# EAGLE design ardustatversion9 (EAGLE 6.1)
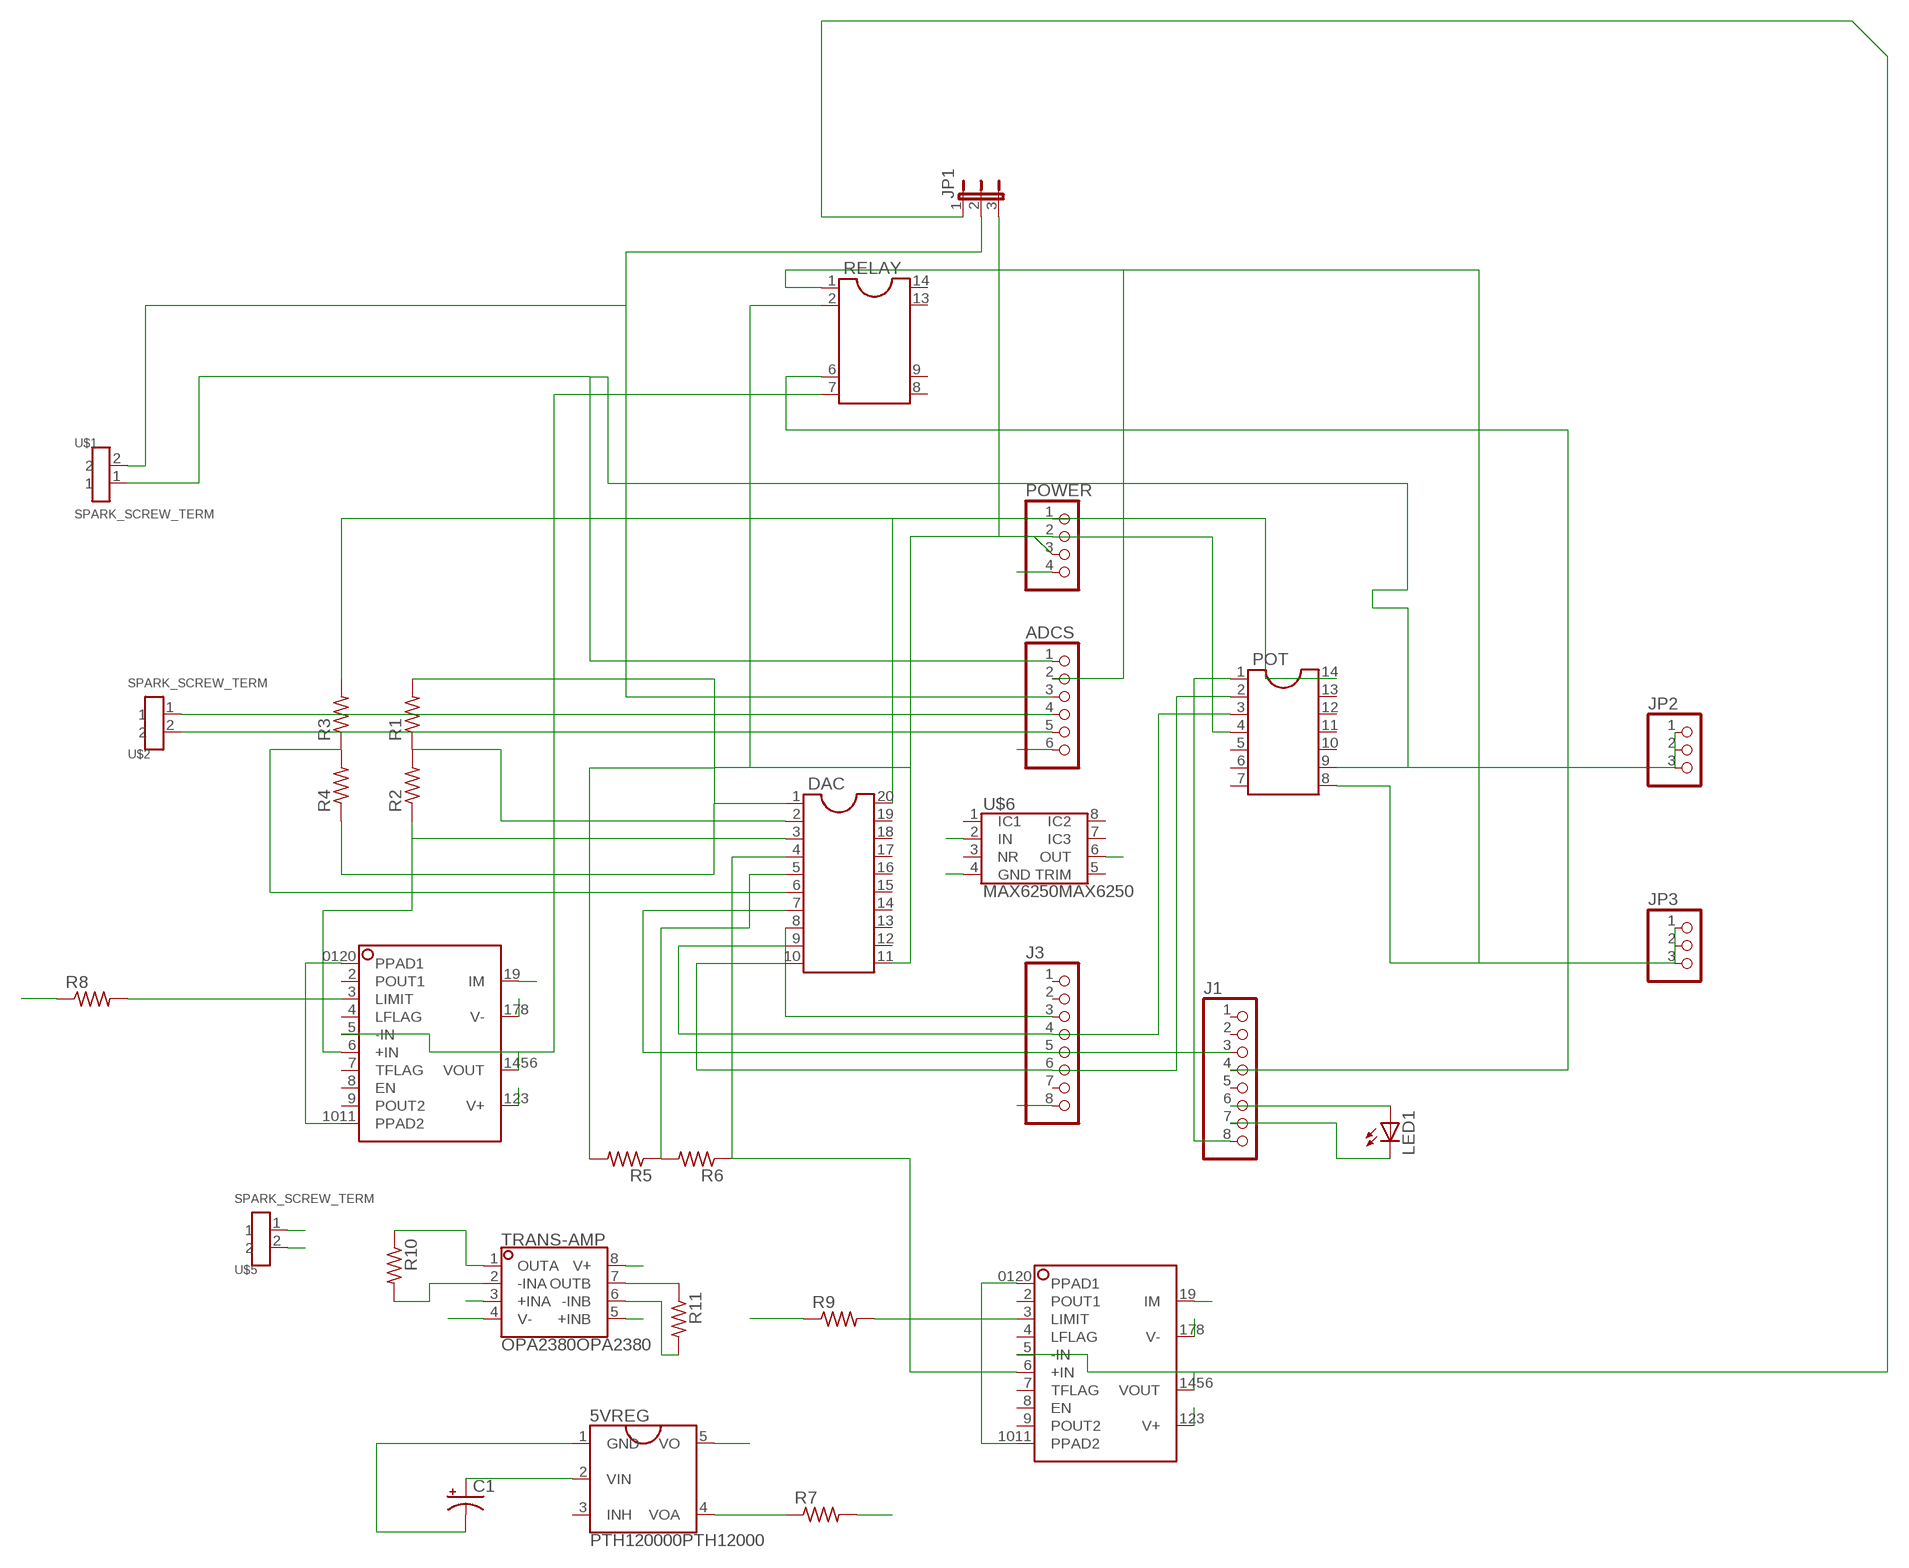
[diagram p0: schematic, sheet 1]

## Parts
5VREG  PTH120000PTH12000  [PTH120000]
ADCS  PINHD-1X6  [1X06]
C1  CPOL-USE5-10.5  [E5-10,5]
DAC  DIL20S  [SOCKED-20]
J1  PINHD-1X8  [1X08]
J3  PINHD-1X8  [1X08]
JP1  JP2E  [JP2]
JP2  PINHD-1X3  [1X03]
JP3  PINHD-1X3  [1X03]
LED1  LED5MM  [LED5MM]
POT  DIL14S  [SOCKET-14]
POWER  PINHD-1X4  [1X04]
R1  R-US_R1206  [R1206]
R2  R-US_R1206  [R1206]
R3  R-US_R1206  [R1206]
R4  R-US_R1206  [R1206]
R5  R-US_R1206  [R1206]
R6  R-US_R1206  [R1206]
R7  R-US_M1206  [M1206]
R8  R-US_R1206  [R1206]
R9  R-US_M1206  [M1206]
R10  R-US_M1206  [M1206]
R11  R-US_M1206  [M1206]
RELAY  DIL14/8  [DIL14/8]
TRANS-AMP  OPA2380OPA2380  [OPA2380]
U$1  SPARK_SCREW_TERM  [SPARK_SCREW_TERM]
U$2  SPARK_SCREW_TERM  [SPARK_SCREW_TERM]
U$3  OPA569OPA569  [OPA569]
U$4  OPA569OPA569  [OPA569]
U$5  SPARK_SCREW_TERM  [SPARK_SCREW_TERM]
U$6  MAX6250MAX6250  [MAX6250]

## Nets
GND: 5VREG.1(GND) C1.- DAC.1 DAC.11 JP1.3 POT.4 POWER.2 POWER.3 R1.2 R4.1 R5.2 R7.2 R8.1 R9.1 RELAY.2 TRANS-AMP.4(V-) U$3.0120(PPAD1) U$3.178(V-) U$3.1011(PPAD2) U$4.0120(PPAD1) U$4.178(V-) U$4.1011(PPAD2) U$5.2 U$6.4(GND)
N$1: DAC.6 R3.1 R4.2
N$2: DAC.10 J3.6 POT.2
N$3: DAC.9 J3.4 POT.3
N$4: DAC.8 J3.3
N$5: DAC.7 J1.3
N$6: J1.4 RELAY.6
N$7: DAC.2 R1.1 R2.2
N$8: ADCS.1 JP2.1 JP2.2 JP2.3 POT.9 U$1.1
N$9: J1.8 POT.1
N$10: R10.2 TRANS-AMP.2(-INA) U$3.19(IM)
N$11: ADCS.2 JP3.1 JP3.2 JP3.3 POT.8 RELAY.1 TRANS-AMP.5(+INB)
N$12: DAC.5 R5.1 R6.2
N$13: R8.2 U$3.3(LIMIT)
N$14: ADCS.5 R10.1 TRANS-AMP.1(OUTA) U$2.2
N$15: DAC.3 R2.1 U$3.6(+IN)
N$16: R9.2 U$4.3(LIMIT)
N$17: J1.6 LED1.A
N$18: J1.7 LED1.K(C)
N$19: 5VREG.5(VO) TRANS-AMP.8(V+) U$3.123(V+) U$4.123(V+)
N$20: ADCS.4 U$2.1
N$21: ADCS.3 JP1.2 TRANS-AMP.3(+INA) U$1.2
N$22: 5VREG.2(VIN) C1.+ POWER.4 U$5.1 U$6.2(IN)
N$24: J3.8 U$6.6(OUT)
N$25: 5VREG.4(VOA) R7.1
N$26: RELAY.7 U$3.5(-IN) U$3.1456(VOUT)
N$27: JP1.1 U$4.5(-IN) U$4.1456(VOUT)
N$29: DAC.20 POT.14 POWER.1 R3.2
N$32: DAC.4 R6.1 U$4.6(+IN)
N$48: ADCS.6 R11.1 TRANS-AMP.7(OUTB)
N$49: R11.2 TRANS-AMP.6(-INB) U$4.19(IM)
Unconnected: 5VREG.3(INH) DAC.12 DAC.13 DAC.14 DAC.15 DAC.16 DAC.17 DAC.18 DAC.19 J1.1 J1.2 J1.5 J3.1 J3.2 J3.5 J3.7 POT.5 POT.6 POT.7 POT.10 POT.11 POT.12 POT.13 RELAY.8 RELAY.9 RELAY.13 RELAY.14 U$3.2(POUT1) U$3.4(LFLAG) U$3.7(TFLAG) U$3.8(EN) U$3.9(POUT2) U$4.2(POUT1) U$4.4(LFLAG) U$4.7(TFLAG) U$4.8(EN) U$4.9(POUT2) U$6.1(IC1) U$6.3(NR) U$6.5(TRIM) U$6.7(IC3) U$6.8(IC2)

## Library data of the parts
5VREG = ardustat:PTH120000
ADCS = pinhead:PINHD-1X6: PIN HEADER
C1 = rcl:CPOL-US: POLARIZED CAPACITOR, American symbol
DAC = ic-package:DIL20: Dual In Line
J1 J3 = pinhead:PINHD-1X8: PIN HEADER
JP1 = jumper:JP2E: JUMPER
JP2 JP3 = pinhead:PINHD-1X3: PIN HEADER
LED1 = led:LED: LED OSRAM: - CHIPLED LG R971, LG N971, LY N971, LG Q971, LY Q971, LO R971, LY R971 LH N974, LH R974 LS Q976, LO Q976, LY Q976 LO Q996 - Hyper CHIPLED LW Q18S LB Q993, LB Q99A, LB R99A - SideLED LS A670, LO A670, LY A670, LG A670, LP A670 LB A673, LV A673, LT A673, LW A673 LH A674 LY A675 LS A676, LA A676, LO A676, LY A676, LW A676 LS A679, LY A679, LG A679 - Hyper Micro SIDELED® LS Y876, LA Y876, LO Y876, LY Y876 LT Y87S - SmartLED LW L88C, LW L88S LB L89C, LB L89S, LG L890 LS L89K, LO L89K, LY L89K LS L896, LA L896, LO L896, LY L896 - TOPLED LS T670, LO T670, LY T670, LG T670, LP T670 LSG T670, LSP T670, LSY T670, LOP T670, LYG T670 LG T671, LOG T671, LSG T671 LB T673, LV T673, LT T673, LW T673 LH T674 LS T676, LA T676, LO T676, LY T676, LB T676, LH T676, LSB T676, LW T676 LB T67C, LV T67C, LT T67C, LS T67K, LO T67K, LY T67K, LW E67C LS E67B, LA E67B, LO E67B, LY E67B, LB E67C, LV E67C, LT E67C LW T67C LS T679, LY T679, LG T679 LS T770, LO T770, LY T770, LG T770, LP T770 LB T773, LV T773, LT T773, LW T773 LH T774 LS E675, LA E675, LY E675, LS T675 LS T776, LA T776, LO T776, LY T776, LB T776 LHGB T686 LT T68C, LB T68C - Hyper Mini TOPLED® LB M676 - Mini TOPLED Santana® LG M470 LS M47K, LO M47K, LY M47K Source: http://www.osram.convergy.de - LUMILED® LXK2-PW12-R00, LXK2-PW12-S00, LXK2-PW14-U00, LXK2-PW14-V00 LXK2-PM12-R00, LXK2-PM12-S00, LXK2-PM14-U00 LXK2-PE12-Q00, LXK2-PE12-R00, LXK2-PE12-S00, LXK2-PE14-T00, LXK2-PE14-U00 LXK2-PB12-K00, LXK2-PB12-L00, LXK2-PB12-M00, LXK2-PB14-N00, LXK2-PB14-P00, LXK2-PB14-Q00 LXK2-PR12-L00, LXK2-PR12-M00, LXK2-PR14-Q00, LXK2-PR14-R00 LXK2-PD12-Q00, LXK2-PD12-R00, LXK2-PD12-S00 LXK2-PH12-R00, LXK2-PH12-S00 LXK2-PL12-P00, LXK2-PL12-Q00, LXK2-PL12-R00 Source: www.luxeon.com
POT = ic-package:DIL14: Dual In Line / Socket
POWER = pinhead:PINHD-1X4: PIN HEADER
R1 R3-R11 = rcl:R-US_: RESISTOR, American symbol
R2 = resistor:R-US_: RESISTOR, American symbol
RELAY = ic-package:DIL14/8: Dual In Line
TRANS-AMP = ardustat:OPA2380
U$1 U$2 U$5 = ardustat:SPARK_SCREW_TERM
U$3 U$4 = ardustat:OPA569
U$6 = ardustat:MAX6250

## Board
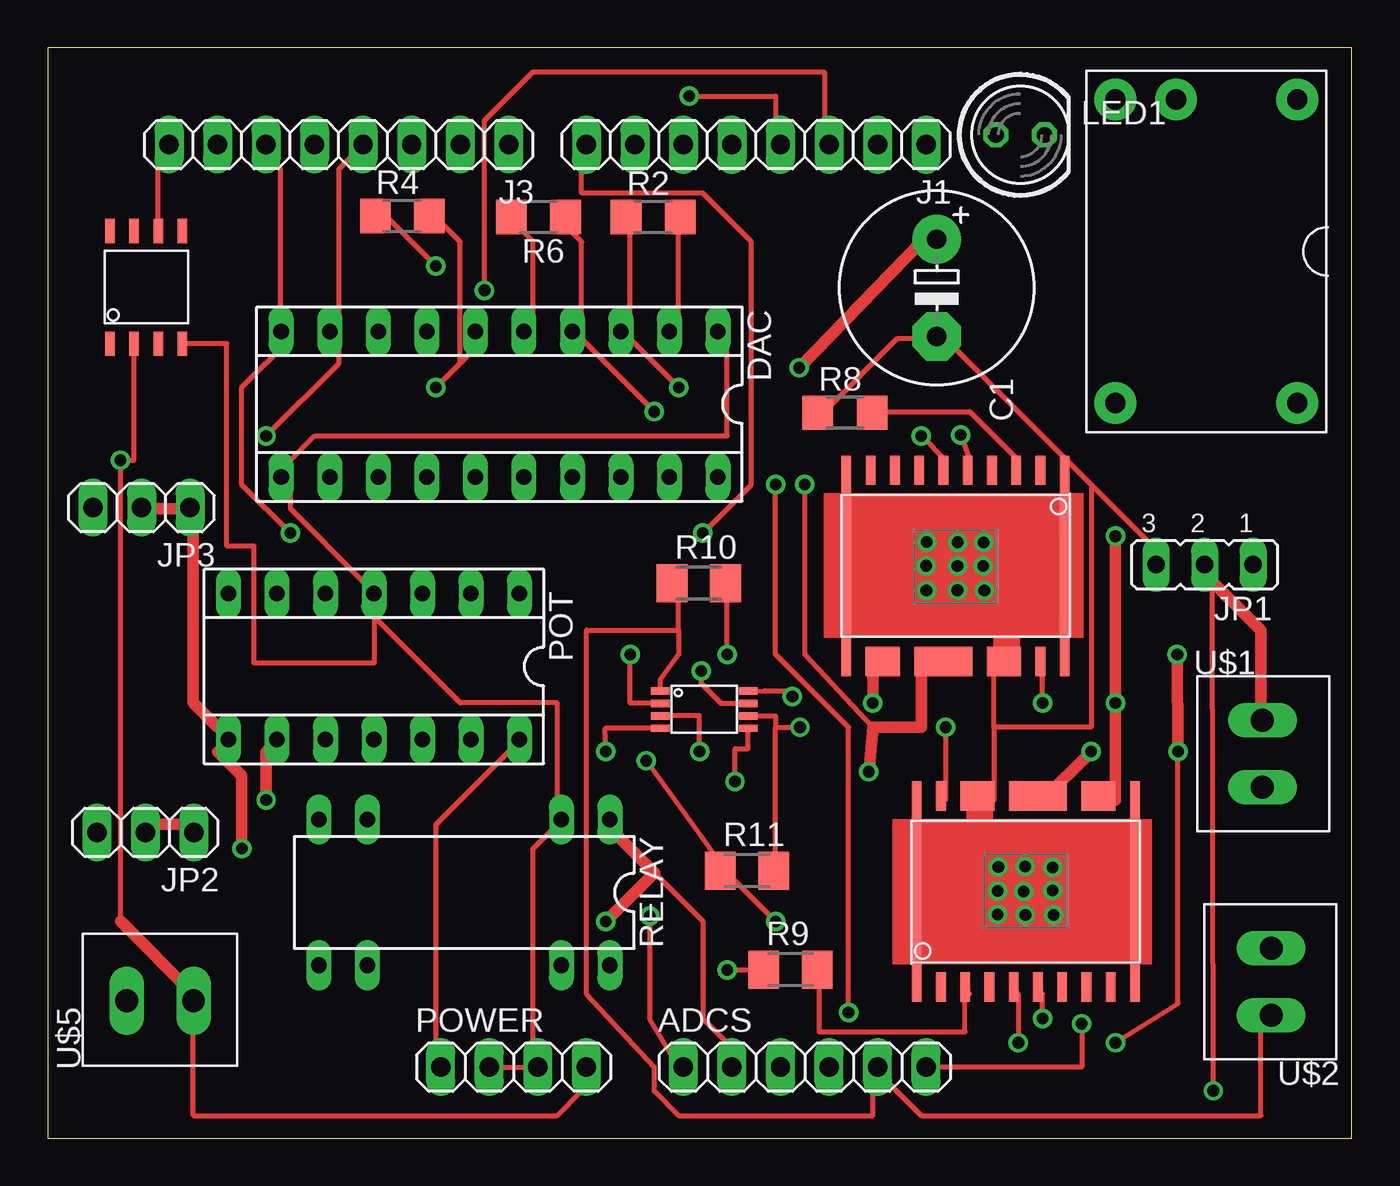
[diagram p1: board, top side]
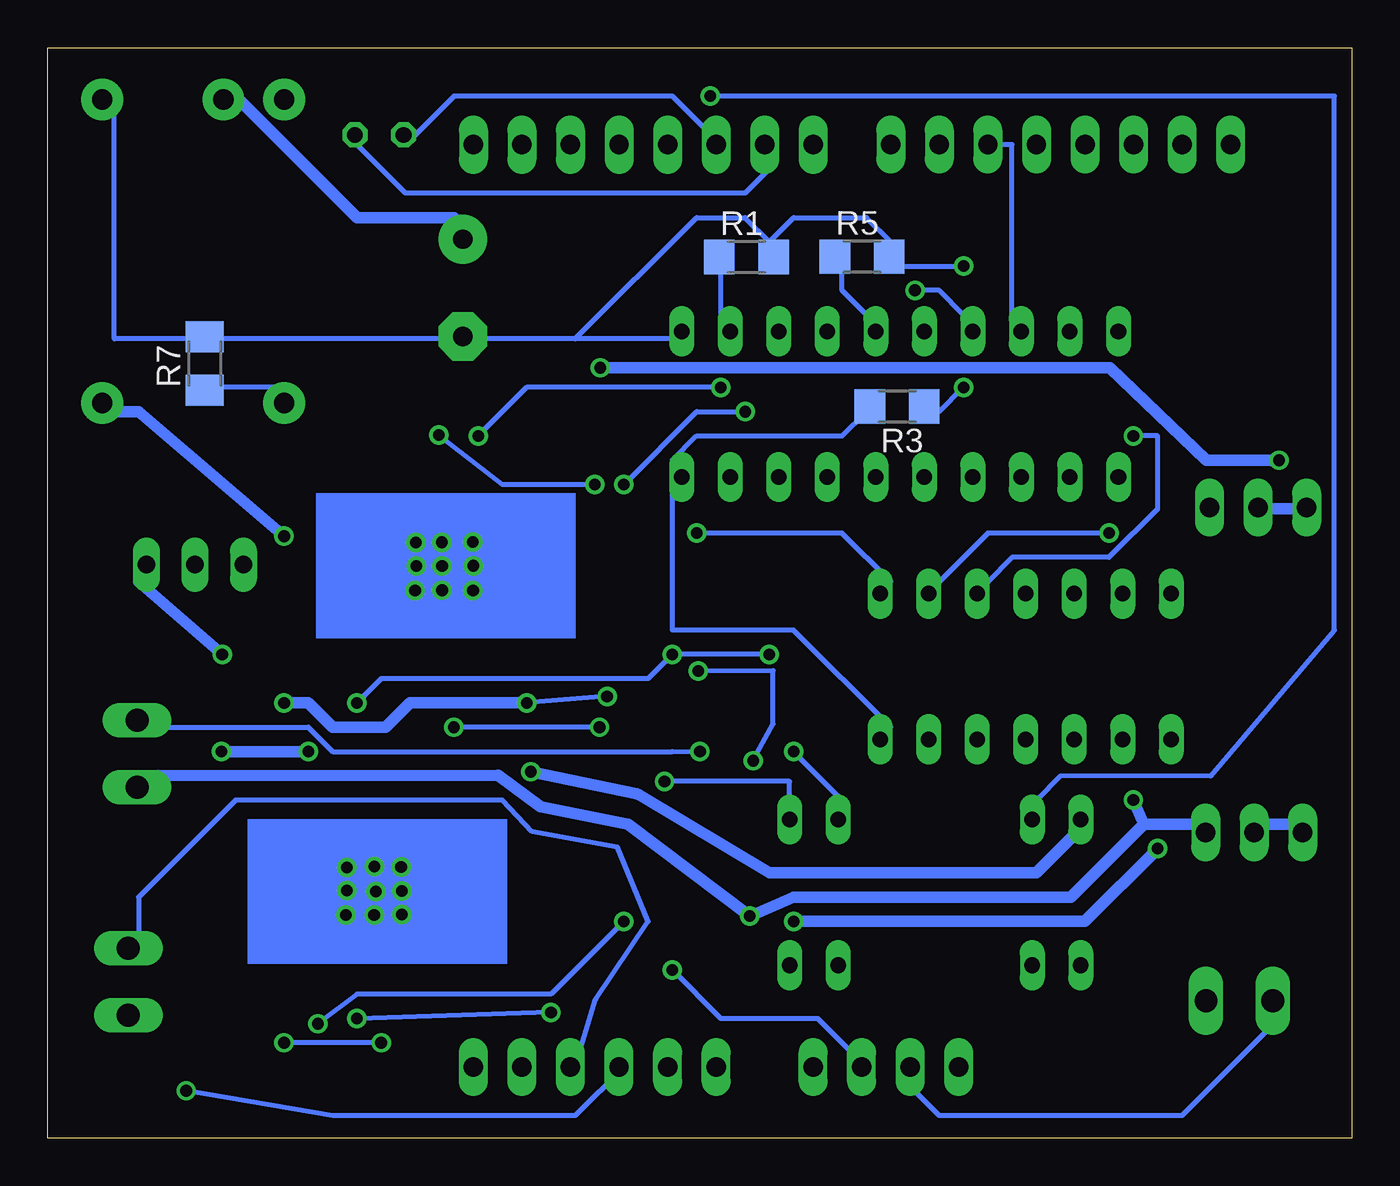
[diagram p2: board, bottom side, seen from below]

Size 68.25 x 57.05 mm. Coordinates in mm from the lower left corner, seen from the top.
Outline: 0,0 68.25,0 68.25,57.05 0,57.05 0,0
Copper layers (1*16): Top 0.035mm / dielectric 1.5mm / Bottom 0.035mm
Design rules: minimum track width 10mil, minimum drill 24mil, track to track 8mil, track to pad 8mil, pad to pad 8mil, via to via 8mil, smd to smd 8mil, copper to edge 40mil, drill to drill 8mil, minimum pad ring 10mil, minimum via ring 8mil, stop-mask expansion 4mil, vias tented up to drill 0mil, thermal gap 0mil

### Footprints (pad centres in the part's own frame; a part is rotated, then mirrored left to right if it is on the bottom)
PTH120000 = drill 1.06 pad 2.184: 1 -7.94,4.76; 2 -7.94,-1.59; 3 -7.94,-4.76; 4 7.94,-4.76; 5 7.94,4.76
1X06 = drill 1.016 long: 1 -6.35,0; 2 -3.81,0; 3 -1.27,0; 4 1.27,0; 5 3.81,0; 6 6.35,0
E5-10,5 = drill 1.016 pad 2.54: + -2.54,0 | drill 1.016 pad 2.54 octagon: - 2.54,0
SOCKED-20 = drill 0.813 long: 1 -11.43,-3.81; 2 -8.89,-3.81; 3 -6.35,-3.81; 4 -3.81,-3.81; 5 -1.27,-3.81; 6 1.27,-3.81; 7 3.81,-3.81; 8 6.35,-3.81; 9 8.89,-3.81; 10 11.43,-3.81; 11 11.43,3.81; 12 8.89,3.81; 13 6.35,3.81; 14 3.81,3.81; 15 1.27,3.81; 16 -1.27,3.81; 17 -3.81,3.81; 18 -6.35,3.81; 19 -8.89,3.81; 20 -11.43,3.81
1X08 = drill 1.016 long: 1 -8.89,0; 2 -6.35,0; 3 -3.81,0; 4 -1.27,0; 5 1.27,0; 6 3.81,0; 7 6.35,0; 8 8.89,0
JP2 = drill 0.914 long: 1 -2.54,0; 2 0,0; 3 2.54,0
1X03 = drill 1.016 long: 1 -2.54,0; 2 0,0; 3 2.54,0
LED5MM = drill 0.813 octagon: A -1.27,0; K 1.27,0
SOCKET-14 = drill 0.813 long: 1 -7.62,-3.81; 2 -5.08,-3.81; 3 -2.54,-3.81; 4 0,-3.81; 5 2.54,-3.81; 6 5.08,-3.81; 7 7.62,-3.81; 8 7.62,3.81; 9 5.08,3.81; 10 2.54,3.81; 11 0,3.81; 12 -2.54,3.81; 13 -5.08,3.81; 14 -7.62,3.81
1X04 = drill 1.016 long: 1 -3.81,0; 2 -1.27,0; 3 1.27,0; 4 3.81,0
R1206 = smd 1.6 x 1.803: 1 -1.422,0; 2 1.422,0
M1206 = smd 1.6 x 2: 1 -1.4,0; 2 1.4,0
DIL14/8 = drill 0.813 long: 1 -7.62,-3.81; 2 -5.08,-3.81; 6 5.08,-3.81; 7 7.62,-3.81; 8 7.62,3.81; 9 5.08,3.81; 13 -5.08,3.81; 14 -7.62,3.81
OPA2380 = smd 0.975 x 0.38: 1 -2.259,0.982; 2 -2.259,0.332; 3 -2.259,-0.318; 4 -2.259,-0.968; 5 2.351,-0.968; 6 2.351,-0.318; 7 2.351,0.332; 8 2.351,0.982
SPARK_SCREW_TERM = drill 1.2 long: 1 0,-1.8; 2 0,1.7
OPA569 = smd 1.53 x 0.51: 2 -5,4.343; 3 -5,3.073; 4 -5,1.803; 5 -5,0.533; 6 -5,-0.737; 7 -5,-2.007; 8 -5,-3.277; 9 -5,-4.547; 19 5,4.343 | smd 11.53 x 0.51: 0120 0,5.613; 1011 0,-5.817 | smd 1.53 x 1.781: 123 5,-3.913; 178 5,2.438 | smd 1.53 x 3.051: 1456 5,-0.738
MAX6250 = smd 1.27 x 0.49: 1 -3.012,1.903; 2 -3.012,0.633; 3 -3.012,-0.637; 4 -3.012,-1.907; 5 2.888,-1.907; 6 2.888,-0.637; 7 2.888,0.633; 8 2.888,1.903

### Placement (x,y rotation side)
5VREG  60.64,46.4 270 top
ADCS  39.62,3.72 0 top
C1  46.53,44.49 270 top
DAC  23.64,38.4 180 top
J1  37.08,51.97 180 top
J3  15.24,51.98 180 top
JP1  60.55,30 180 top
JP2  5.11,15.99 180 top
JP3  4.91,32.99 180 top
LED1  50.9,52.49 0 top
POT  17.07,24.68 180 top
POWER  24.38,3.71 0 top
R1  31.68,46.1 0 bottom
R2  31.69,48.19 0 top
R3  23.79,38.28 180 bottom
R4  18.56,48.24 0 top
R5  25.63,46.11 0 bottom
R6  25.68,48.2 180 top
R7  60.03,40.53 90 bottom
R8  41.73,37.95 0 top
R9  38.87,8.81 0 top
R10  34.07,29.02 0 top
R11  36.6,13.99 0 top
RELAY  21.81,12.85 180 top
TRANS-AMP  34.31,22.4 0 top
U$1  63.58,20.15 0 top
U$2  64.03,8.14 180 top
U$3  47.61,29.94 270 top
U$4  51.09,12.9 90 top
U$5  5.83,7.18 90 top
U$6  5.15,44.58 90 top

### Tracks (layer width: path | path; a pad name or v marks a point on that pad's centre or on a via)
GND  (via drill 0.61)
  Top 0.254: 41.88,32.02 41.91,32.02 41.91,31.3 41.8,31.3 U$3.1011 | 53.06,31.96 53.23,31.96 U$3.0120 | 50.12,24.94 U$3.178 49.53,25.31 49.53,21.5 | U$4.0120 48.77,12.9 U$4.1011 | POT.4 16.51,29.12 12.7,32.93 12.7,34.2 DAC.11 12.7,35.47 13.97,36.74 35.56,36.74 35.56,41.82 DAC.1 | v29.21,20.23 29.18,21.44 31.75,21.44 TRANS-AMP.4 | v35.56,8.8 36.83,8.8 R9.1 | 25.4,3.72 22.86,3.72 POWER.2 | 25.4,3.72 25.4,15.15 26.67,16.42 RELAY.2 26.67,17.69 26.67,22.77 21.59,22.77 16.51,27.85 POT.4 | 25.4,3.72 POWER.3 | 49.53,21.5 49.53,17.69 U$4.178 | v20.32,45.63 17.78,48.17 R4.1 | R8.1 40.64,38.01 44.45,41.82 45.72,41.82 C1.- 46.99,41.82 54.61,34.2 | 54.61,34.2 58.42,30.39 JP1.3 | 49.53,21.5 54.61,21.5 54.61,34.2 | U$6.4 9.37,41.57 9.37,30.98 10.79,30.98 10.79,24.85 17.07,24.85 POT.4
  Top 0.406: 41.88,32.02 50.21,32.02 53.06,32.02 53.06,31.96
  Top 1.422: U$3.178 50.21,24.94 50.21,32.02 | U$4.178 48.77,17.9 48.77,12.9
  Bottom 0.254: v29.21,20.23 26.67,17.69 RELAY.2 | v35.56,8.8 33.02,6.26 27.94,6.26 25.4,3.72 POWER.3 | U$5.2 3.81,6.26 8.89,1.18 21.59,1.18 22.86,2.45 POWER.2 | 30.48,46.9 29.21,48.17 25.4,48.17 24.13,46.9 R5.2 24.13,45.63 v20.32,45.63 | 40.64,41.82 45.72,41.82 C1.- 46.99,41.82 59.69,41.82 R7.2 60.96,41.82 64.77,41.82 64.77,54.52 5VREG.1 | 40.64,41.82 35.56,41.82 DAC.1 | 30.48,46.9 31.75,48.17 34.29,48.17 40.64,41.82 | 30.48,46.9 R1.2
N$1  (via drill 0.61)
  Top 0.254: 21.59,40.55 22.86,41.82 DAC.6 | v20.32,39.28 21.59,40.55 | 21.59,40.55 21.59,46.9 20.32,48.17 R4.2
  Bottom 0.254: v20.32,39.28 21.59,38.01 R3.1
N$2  (via drill 0.61)
  Top 0.254: v12.7,31.66 10.16,34.2 10.16,39.28 12.7,41.82 DAC.10 12.18,43.06 12.18,50.68 J3.6
  Bottom 0.254: v12.7,31.66 19.05,31.66 21.59,29.12 POT.2
N$3  (via drill 0.61)
  Top 0.254: v11.43,36.74 15.24,40.55 15.24,41.82 DAC.9 15.24,43.09 15.24,50.71 J3.4
  Bottom 0.254: v11.43,36.74 10.16,36.74 10.16,32.93 12.7,30.39 17.78,30.39 19.05,29.12 POT.3
N$4
  Bottom 0.254: DAC.8 17.78,43.09 17.78,51.98 J3.3
N$5  (via drill 0.61)
  Top 0.254: v22.86,44.36 22.86,53.25 25.4,55.79 40.64,55.79 40.64,51.98 J1.3
  Bottom 0.254: v22.86,44.36 21.59,44.36 20.32,43.09 DAC.7
N$6  (via drill 0.61)
  Top 0.254: v33.58,54.52 38.1,54.52 38.1,51.98 J1.4
  Bottom 0.254: v33.58,54.52 0.91,54.52 0.91,26.58 7.39,18.93 15.24,18.96 16.51,17.69 RELAY.6
N$7
  Top 0.254: R2.2 33.02,48.17 33.02,43.09 DAC.2
  Bottom 0.254: R1.1 33.02,45.63 33.02,43.09 DAC.2
N$8  (via drill 0.61)
  Top 0.254: v31.5,11.61 31.5,6.21 33.02,3.72 ADCS.1 | JP2.2 5.08,16.42 | 7.62,16.42 JP2.1
  Top 0.61: v11.43,17.69 11.43,20.23 POT.9 | 5.08,16.42 7.62,16.42
  Bottom 0.254: JP2.3 2.54,16.42 | 5.08,16.42 JP2.2 | JP2.1 7.62,16.42 | 63.5,18.96 U$1.1
  Bottom 0.61: 2.54,16.42 5.08,16.42 | 10.88,16.42 v11.43,17.69 | 7.62,16.42 10.88,16.42 | 10.88,16.42 14.69,12.61 29.21,12.61 v31.5,11.61 37.88,16.41 42.47,17.33 44.69,18.99 63.5,18.96
N$9  (via drill 0.61)
  Top 0.254: v34.29,31.66 36.83,34.2 36.83,46.9 34.29,49.44 27.94,49.44 27.94,50.71 J1.8
  Bottom 0.254: v34.29,31.66 26.67,31.66 24.13,29.12 POT.1
N$10  (via drill 0.61)
  Top 0.254: v52.07,22.77 52.07,25.31 U$3.19 | v35.56,25.31 35.56,29.12 R10.2 | v30.48,25.31 30.48,22.77 32.05,22.77 TRANS-AMP.2 31.75,22.77
  Bottom 0.254: v52.07,22.77 50.8,24.04 36.83,24.04 v35.56,25.31 v30.48,25.31
N$11  (via drill 0.61)
  Top 0.254: 8.89,21.5 POT.8 8.89,20.23 | 5.08,32.93 JP3.2 | 7.62,32.93 JP3.1 | 31.75,13.88 34.29,11.34 34.29,6.26 35.56,4.99 35.56,3.72 ADCS.2 | 29.21,16.42 RELAY.1 | v35.97,18.66 35.97,20.37 36.66,20.37 TRANS-AMP.5
  Top 0.61: 8.89,21.5 7.62,22.77 7.62,32.93 5.08,32.93 | 29.21,16.42 31.75,13.88 v29.21,11.34 | 8.89,20.23 10.16,18.96 v10.16,15.15
  Bottom 0.254: 2.54,32.93 JP3.3 | JP3.2 5.08,32.93 | v35.97,18.66 29.43,18.66 RELAY.1
  Bottom 0.61: 5.08,32.93 2.54,32.93 | v10.16,15.15 13.97,11.34 v29.21,11.34
N$12
  Top 0.254: R6.2 24.13,48.17 25.4,46.9 25.4,43.09 DAC.5
  Bottom 0.254: R5.1 26.67,45.63 26.67,44.36 25.4,43.09 DAC.5
N$13
  Top 0.254: U$3.3 50.8,35.47 48.26,38.01 43.18,38.01 R8.2
N$14
  Top 0.254: 33.02,26.58 33.02,29.12 R10.1 | 33.02,26.58 33.02,25.31 32.06,23.98 32.05,23.98 TRANS-AMP.1 | 43.18,3.72 45.72,1.18 63.5,1.18 63.5,6.26 U$2.2 | 33.02,26.58 28.2,26.58 28.2,7.53 31.75,3.72 31.75,2.45 33.02,1.18 43.18,1.18 43.18,3.72 | 43.18,3.72 ADCS.5
N$15  (via drill 0.61)
  Top 0.254: v45.72,36.74 46.99,35.47 U$3.6 | v33.02,39.28 30.48,41.82 DAC.3 30.48,43.09 30.48,48.17 R2.1
  Bottom 0.254: v45.72,36.74 43.18,39.28 v33.02,39.28
N$16
  Top 0.254: 48.26,7.53 U$4.3 48.02,5.55 40.37,5.55 40.37,8.8 40.64,8.8 R9.2
N$17
  Bottom 0.254: LED1.A 49.53,51.98 46.99,54.52 35.56,54.52 33.02,51.98 J1.6
N$18
  Bottom 0.254: LED1.K 52.07,51.98 49.53,49.44 31.75,49.44 30.48,50.71 J1.7
N$19  (via drill 0.61)
  Top 0.254: v38.97,23.11 39,23.41 37.52,23.41 TRANS-AMP.8 | 43.18,25.31 U$3.123 | 55.88,17.69 U$4.123
  Top 0.61: v43.18,22.77 43.18,25.31 | v55.88,31.49 v55.88,22.77 55.88,17.69
  Bottom 0.254: v38.97,23.11 v43.18,22.77 | 64.77,38.01 5VREG.5
  Bottom 0.61: v55.88,31.49 63.5,38.01 64.77,38.01 | v43.18,22.77 49.3,22.77 50.56,21.5 53.34,21.5 54.61,22.77 v55.88,22.77
N$20
  Bottom 0.254: ADCS.4 40.64,3.72 39.57,7.26 36.83,11.34 38.42,15.21 42.89,16.03 44.45,17.69 58.42,17.69 63.5,12.61 63.5,10.07 U$2.1
N$21  (via drill 0.61)
  Top 0.254: 63.5,21.5 U$1.2 | v61.01,2.48 60.96,29.12 JP1.2 | v34.12,20.23 34.11,22.11 TRANS-AMP.3
  Top 0.61: 60.96,29.12 63.5,26.58 63.5,21.5
  Bottom 0.254: v34.12,20.23 35.56,20.23 53.34,20.23 54.61,21.5 63.5,21.5 U$1.2 | v61.01,2.48 53.34,1.18 40.64,1.18 38.1,3.72 ADCS.3
N$22  (via drill 0.61)
  Top 0.254: POWER.4 27.94,2.45 26.67,1.18 7.62,1.18 7.62,6.26 U$5.1 7.62,7.53 | 3.81,11.34 v3.81,35.47 4.52,35.47 U$6.2
  Top 0.61: v39.34,40.31 45.72,46.9 C1.+ | 7.62,7.53 3.81,11.34
  Bottom 0.61: 5VREG.2 58.42,54.52 52.07,48.17 46.99,48.17 C1.+ | v39.34,40.31 12.67,40.31 7.62,35.47 v3.81,35.47
N$23  (via drill 0.61)
  other vias: 49.75,14.18
N$24
  Top 0.254: U$6.6 5.79,51.98 J3.8
N$25
  Bottom 0.254: R7.1 59.69,39.28 55.88,39.28 5VREG.4
N$26  (via drill 0.61)
  Top 0.254: v47.79,36.78 48.26,35.47 U$3.5 | v39.62,34.2 39.62,25.31 43.18,21.5 | 45.72,25.31 U$3.1456
  Top 0.61: 45.72,25.31 45.72,21.5 43.18,21.5 v42.97,19.17
  Bottom 0.254: v47.79,36.78 44.45,34.2 v39.62,34.2 | RELAY.7 13.97,16.42
  Bottom 0.61: v42.97,19.17 37.44,18.03 37.31,17.97 30.48,13.88 16.51,13.88 13.97,16.42
N$27  (via drill 0.61)
  Top 0.254: v50.8,4.99 50.8,7.53 U$4.5 | v55.88,4.99 59.16,7.04 v59.16,20.23 | 52.07,17.69 U$4.1456
  Top 0.61: v59.16,20.23 v59.12,25.31 | v54.61,20.23 52.07,17.69
  Bottom 0.254: v50.8,4.99 v55.88,4.99 | 63.5,29.12 JP1.1
  Bottom 0.61: v59.12,25.31 63.5,29.12 | v59.16,20.23 v54.61,20.23
N$28  (via drill 0.61)
  other vias: 49.72,12.92
N$29
  Top 0.254: POT.14 24.13,20.23 20.32,16.42 20.32,3.72 POWER.1
  Bottom 0.254: R3.2 25.4,38.01 26.67,36.74 34.29,36.74 35.56,35.47 DAC.20 35.56,34.2 35.56,26.58 29.21,26.58 24.13,21.5 POT.14
N$30  (via drill 0.61)
  other vias: 49.71,11.7
N$31  (via drill 0.61)
  other vias: 51.17,11.68
N$32  (via drill 0.61)
  Top 0.254: v52.07,6.26 52.07,7.53 U$4.6 | v41.91,6.58 41.91,21.5 38.1,25.31 v38.1,34.2 | v31.75,38.01 27.94,41.82 DAC.4 27.94,43.09 27.94,46.9 26.67,48.17 R6.1
  Bottom 0.254: v41.91,6.58 v52.07,6.26 | v38.1,34.2 34.29,38.01 v31.75,38.01
N$33  (via drill 0.61)
  other vias: 52.64,11.67
N$34  (via drill 0.61)
  other vias: 52.6,12.96
N$35  (via drill 0.61)
  other vias: 52.59,14.16
N$36  (via drill 0.61)
  other vias: 51.15,14.21
N$37  (via drill 0.61)
  other vias: 51.08,12.91
N$38  (via drill 0.61)
  other vias: 47.61,29.94
N$39  (via drill 0.61)
  other vias: 48.97,29.93
N$40  (via drill 0.61)
  other vias: 45.98,29.94
N$41  (via drill 0.61)
  other vias: 47.61,28.66
N$42  (via drill 0.61)
  other vias: 47.62,31.17
N$43  (via drill 0.61)
  other vias: 46,31.18
N$44  (via drill 0.61)
  other vias: 45.99,28.66
N$45  (via drill 0.61)
  other vias: 49.03,28.66
N$46  (via drill 0.61)
  other vias: 48.98,31.16
N$48  (via drill 0.61)
  Top 0.254: 35.56,13.88 34.24,15.73 v31.33,19.74 | 36.83,22.77 TRANS-AMP.7 35.24,22.74 34.2,23.79 v34.2,24.43 | v54.11,5.98 54.11,3.72 ADCS.6 45.72,3.72 | 35.56,13.88 v38.1,11.34 | R11.1 35.56,13.88
  Bottom 0.254: v31.33,19.74 31.42,19.63 30.28,21.67 30.28,24.46 v34.2,24.43 | v54.11,5.98 52.07,7.53 41.91,7.53 v38.1,11.34
N$49  (via drill 0.61)
  Top 0.254: v46.99,21.5 46.99,17.69 U$4.19 | 38.1,21.5 v39.37,21.5 | 38.1,21.5 38.1,13.88 R11.2 | TRANS-AMP.6 38.1,22.09 38.1,21.5
  Bottom 0.254: v39.37,21.5 v46.99,21.5
(copper drawn outside any net)
  shapes: Bottom area x2, Top area x2